# Altium schematic sheet Master Micro Controller Core.SchDoc: Main MicroController Core
size 292 x 193 mm; SheetNumber: 10; SheetTotal: 28
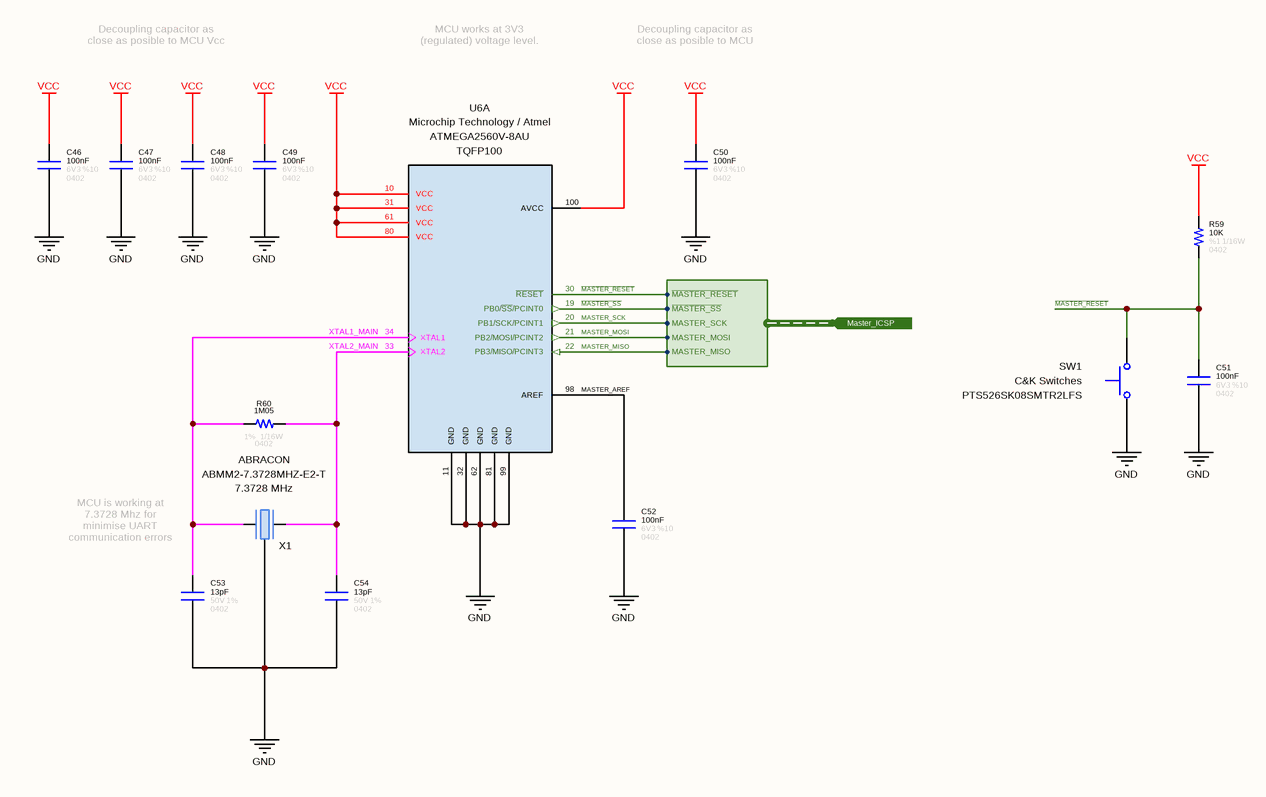
[diagram p0: Master Micro Controller Core.SchDoc]

## Parts
C46  value 100nF  Tolerance: %10  Voltage: 6V3  Case: 0402  [CAPACITOR_0402]  (hidden comment: Capacitor - 100nF [0402] (Ceramic))
C47  value 100nF  Tolerance: %10  Voltage: 6V3  Case: 0402  [CAPACITOR_0402]  (hidden comment: Capacitor - 100nF [0402] (Ceramic))
C48  value 100nF  Tolerance: %10  Voltage: 6V3  Case: 0402  [CAPACITOR_0402]  (hidden comment: Capacitor - 100nF [0402] (Ceramic))
C49  value 100nF  Tolerance: %10  Voltage: 6V3  Case: 0402  [CAPACITOR_0402]  (hidden comment: Capacitor - 100nF [0402] (Ceramic))
C50  value 100nF  Tolerance: %10  Voltage: 6V3  Case: 0402  [CAPACITOR_0402]  (hidden comment: Capacitor - 100nF [0402] (Ceramic))
C51  value 100nF  Tolerance: %10  Voltage: 6V3  Case: 0402  [CAPACITOR_0402]  (hidden comment: Capacitor - 100nF [0402] (Ceramic))
C52  value 100nF  Tolerance: %10  Voltage: 6V3  Case: 0402  [CAPACITOR_0402]  (hidden comment: Capacitor - 100nF [0402] (Ceramic))
C53  value 13pF  Tolerance: 1%  Case: 0402  Voltage: 50V  [CAPACITOR_0402]  (hidden comment: Capacitor - 13pF [0402] (Ceramic))
C54  value 13pF  Tolerance: 1%  Case: 0402  Voltage: 50V  [CAPACITOR_0402]  (hidden comment: Capacitor - 13pF [0402] (Ceramic))
R59  value 10K  Tolerance: %1  Case: 0402  Power: 1/16W  [RESISTOR_0402]  (hidden comment: 10K - 0402 - %1 - 1/16W)
R60  value 1M05  Power: 1/16W  Case: 0402  Tolerance: 1%  [RESISTOR_0402]  (hidden comment: 1M05 - 0402 - %1 - 1/16W)
SW1  Manufacturer Name: C&K Switches  [PTS526_Switch]  (hidden comment: PTS526SK08SMTR2LFS)
U6  Manufacturer Name: Microchip Technology / Atmel  Case: TQFP100  [TQFP-100]  (hidden comment: ATMEGA2560V-8AU)  (part A of 16)
X1  Manufacturer Name: ABRACON  Frequency: 7.3728 MHz  [CRYSTAL - 7.3728 MHz]  (hidden comment: ABMM2-7.3728MHZ-E2-T)

## Ports
Master_ICSP (in, harness Master_ICSP)

## Harnesses
Master_ICSP: MASTER_MOSI, MASTER_MISO, MASTER_SCK, ~{MASTER_RESET}, ~{MASTER_SS}

## Nets
GND: C46.1 C47.1 C48.1 C49.1 C50.1 C51.1 C52.1 C53.1 C54.1 SW1.1(NC) U6.11(GND) U6.32(GND) U6.62(GND) U6.81(GND) U6.99(GND) X1.2(GND)
VCC: C46.2 C47.2 C48.2 C49.2 C50.2 R59.2 U6.10(VCC) U6.31(VCC) U6.61(VCC) U6.80(VCC) U6.100(AVCC)
~{MASTER_RESET}: C51.2 R59.1 SW1.2(COM) U6.30(~{RESET}) ; port Master_ICSP.~{MASTER_RESET}
~{MASTER_SS}: U6.19(PB0/~{SS}/PCINT0) ; port Master_ICSP.~{MASTER_SS}
MASTER_AREF: C52.2 U6.98(AREF)
MASTER_MISO: U6.22(PB3/MISO/PCINT3) ; port Master_ICSP.MASTER_MISO
MASTER_MOSI: U6.21(PB2/MOSI/PCINT2) ; port Master_ICSP.MASTER_MOSI
MASTER_SCK: U6.20(PB1/SCK/PCINT1) ; port Master_ICSP.MASTER_SCK
XTAL1_MAIN: C53.2 R60.1 U6.34(XTAL1) X1.3(OUT/IN)
XTAL2_MAIN: C54.2 R60.2 U6.33(XTAL2) X1.1(IN/OUT)

Not connected (* = marked no-connect by the designer): X1 4(GND)

## Notes on the sheet
- Decoupling capacitor as close as posible to MCU Vcc pins.
- MCU works at 3V3 (regulated) voltage level.
- Decoupling capacitor as close as posible to MCU AVcc pin.
- (near C53) MCU is working at 7.3728 Mhz for minimise UART communication errors (115200bps).
- © 2021 All rights reserved.
  This document may not, in whole or in part, be copied, photocopied, reproduced, translated or converted to any electronic or machine readable from without prior written permission of Mehmet Günce Akkoyun.
  Engineer contact : akkoyun@me.com
- Property of
- Engineer :
- Date :
- Size :
- A4
- Time :
- Project :
- Page :
- /
- Customer :
- Product ID :
- Module ID :
- Version :
- File :
- Revision :

## Library data of the parts
C46-C52 = Capacitor - 100nF [0402-6V3]: Capacitor - 100nF [0402-6V3] (Ceramic); Manufacturer Name: AVX; Manufacturer Part Number: 04026D104KAT4A; ComponentLink1Description: Mouser; ComponentLink1URL: https://www.mouser.com.tr/ProductDetail/AVX/04026D104KAT4A?qs=sGAEpiMZZMs0AnBnWHyRQPg4iYkCw7IMED%2F4kpqgf7w%3D; ComponentLink2Description: DataSheet; ComponentLink2URL: https://www.mouser.com.tr/datasheet/2/40/cx5r-776519.pdf
C53 C54 = Capacitor - 13pF [0402-50V]: Multilayer Ceramic Capacitors - SMD - 50V 13pF X5R 0402 1%; Manufacturer Part Number: CBR04C130F5GAC; Manufacturer Name: KEMET
R59 = Resistor - 10K [0402]: Thick Film Resistors - SMD 1/16 W 10 KOhm 1%; Manufacturer Name: Vishay; Manufacturer Part Number: CRCW040210K0FKED; ComponentLink1Description: DataSheet; ComponentLink1URL: https://www.mouser.com.tr/datasheet/2/427/dcrcwe3-1762152.pdf; ComponentLink2Description: Mouser; ComponentLink2URL: https://www.mouser.com.tr/ProductDetail/Vishay-Dale/CRCW040210K0FKED?qs=sGAEpiMZZMu61qfTUdNhG2DpbjADlD3GcalbOv9utCY%3D
R60 = Resistor - 1M05 [0402]: Thick Film Resistors - SMD 1/16 W 1.05 MOhm 1%; Manufacturer Name: Vishay; Manufacturer Part Number: CRCW04021M05FKED
SW1 = Switch - Push Button: Switch Tactile N.O. SPST Flush Round Button Gull Wing 0.05A 12VDC 200000Cycles 2.45N SMD T/R; Current Rating: 50 mA; Contact Form: SPST; Product Type: Tactile Switches; RoHS: Yes; Voltage Rating: 12 VDC; Case: SMD; Manufacturer Part Number: PTS526SK08SMTR2LFS
U6 = IC - AtMega2560V-8AU: ATmega Series 256 KB Flash 8 KB SRAM 8 MHz 8-Bit Microcontroller - TQFP-100; Program Memory Size: 256 kB; Core: AVR; Operating Supply Voltage: 2.7 V to 5.5 V; Maximum Clock Frequency: 8 MHz; Maximum Operating Temperature: + 85 C; Product Type: MicroControllers; Minimum Operating Temperature: - 40 C; Manufacturer Part Number: ATMEGA2560V-8AU
X1 = Crystal - 7.3728MHz: CRYSTAL 7.3728MHZ 18PF SMD; ESR: 150 Ohms; Product Type: Crystals; Minimum Operating Temperature: - 20 C; Maximum Operating Temperature: + 70 C; Load Capacitance: 18 pF; RoHS: Yes; Case: SMD; Manufacturer Part Number: ABMM2-7.3728MHZ-E2-T